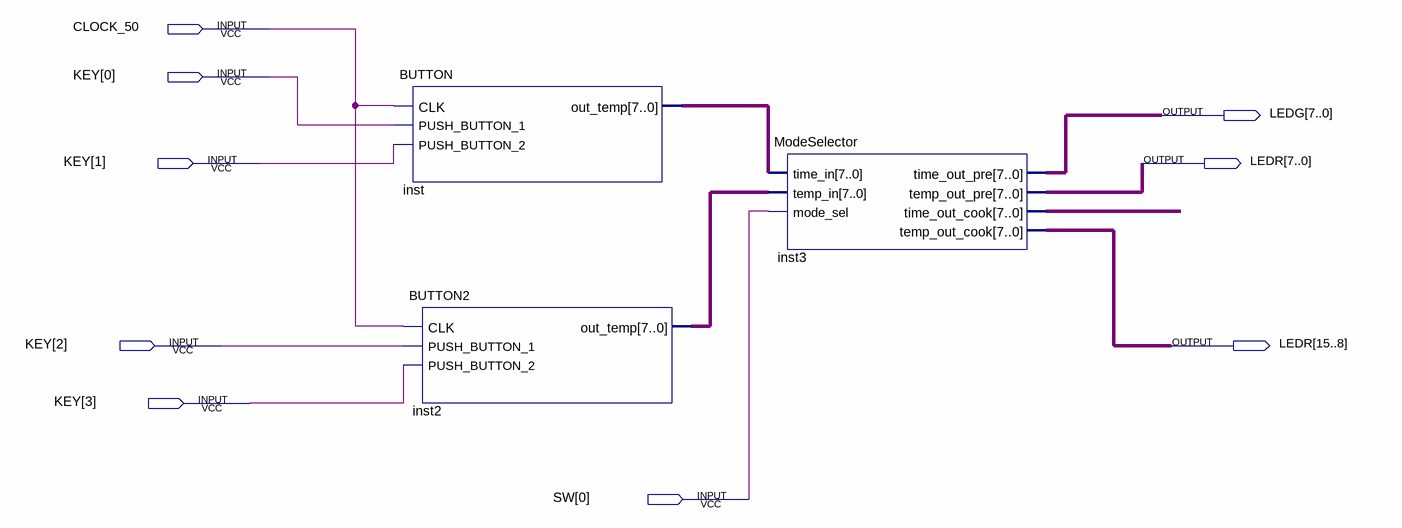
[diagram p0: schematic sheet]
// Quartus schematic BUTTONS_Demo.bdf as structural Verilog: 3 symbols, 9 pins
module BUTTONS_Demo (
  input  CLOCK_50,
  input  [3:0] KEY,
  input  [0:0] SW,
  output [7:0] LEDG,
  output [15:0] LEDR
);

  wire [7:0] inst2_out_temp, inst3_time_out_cook, inst_out_temp;

  BUTTON inst (.CLK(CLOCK_50), .PUSH_BUTTON_1(KEY[0]), .PUSH_BUTTON_2(KEY[1]), .out_temp(inst_out_temp));
  BUTTON2 inst2 (.CLK(CLOCK_50), .PUSH_BUTTON_1(KEY[2]), .PUSH_BUTTON_2(KEY[3]), .out_temp(inst2_out_temp));
  ModeSelector inst3 (
    .time_in(inst_out_temp), .temp_in(inst2_out_temp), .mode_sel(SW[0]), .time_out_pre(LEDG),
    .temp_out_pre(LEDR[7:0]), .time_out_cook(inst3_time_out_cook), .temp_out_cook(LEDR[15:8]));
endmodule
